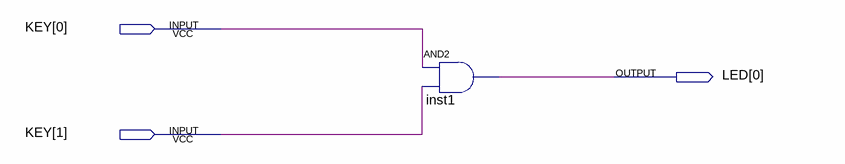
[diagram p0: schematic sheet]
// Quartus schematic and_2.bdf as structural Verilog: 1 symbols, 3 pins
module and_2 (
  input  [1:0] KEY,
  output [0:0] LED
);

  and inst1 (LED[0], KEY[0], KEY[1]);
endmodule
